# Altium schematic sheet Connectors.SchDoc
size A4
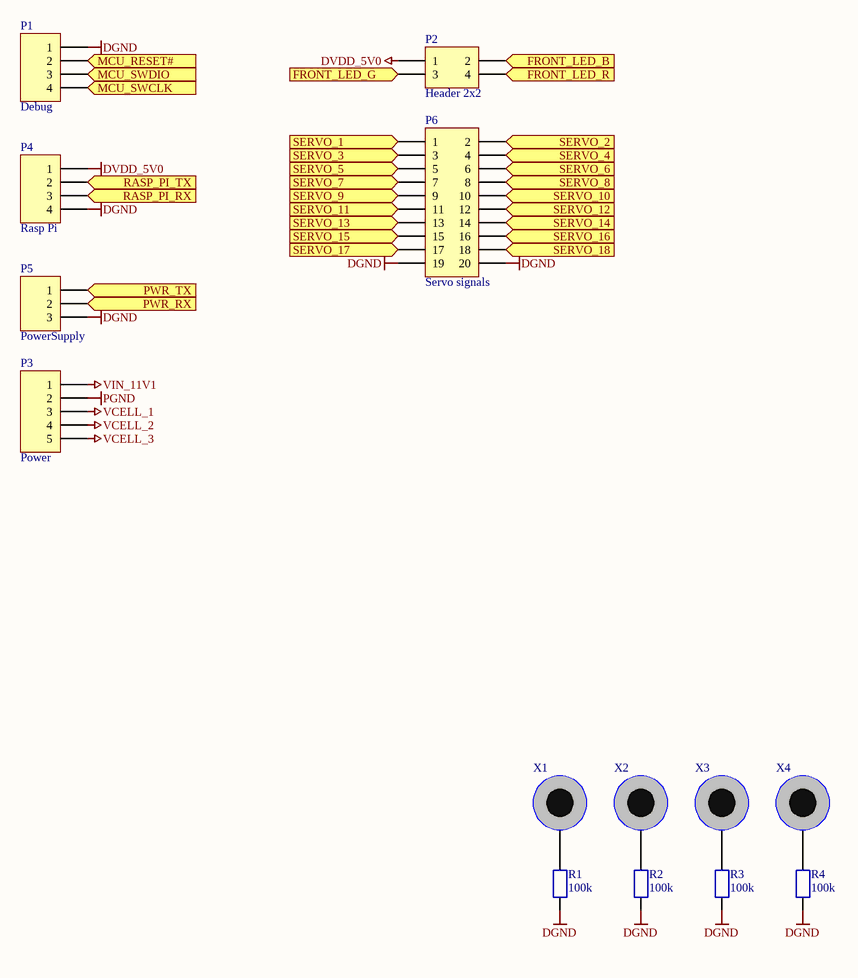
[diagram p0: Connectors.SchDoc]

## Parts
P1  Debug  [HDR_SMD_1X4_1.50]
P2  Header 2x2  [HDR_M_2X2_2.54]
P3  Power  [HDR_M_1X5_2.54_OUTLINE]
P4  Rasp Pi  [HDR_M_1X4_2.54]
P5  PowerSupply  [HDR_M_1X3_2.54]
P6  Servo signals  [HDR_M_2X10_2.54_OUTLINE]
R1  100k  [R_0603/1608]
R2  100k  [R_0603/1608]
R3  100k  [R_0603/1608]
R4  100k  [R_0603/1608]
X1  Mounting hole  [HOLE_M2_D4.0/2.5]  (value not drawn)  (no BOM)
X2  Mounting hole  [HOLE_M2_D4.0/2.5]  (value not drawn)  (no BOM)
X3  Mounting hole  [HOLE_M2_D4.0/2.5]  (value not drawn)  (no BOM)
X4  Mounting hole  [HOLE_M2_D4.0/2.5]  (value not drawn)  (no BOM)

## Ports
FRONT_LED_B, FRONT_LED_G, FRONT_LED_R, MCU_RESET#, MCU_SWCLK, MCU_SWDIO, PWR_RX, PWR_TX, RASP_PI_RX, RASP_PI_TX, SERVO_1, SERVO_2, SERVO_3, SERVO_4, SERVO_5, SERVO_6, SERVO_7, SERVO_8, SERVO_9, SERVO_10, SERVO_11, SERVO_12, SERVO_13, SERVO_14, SERVO_15, SERVO_16, SERVO_17, SERVO_18

## Nets
DGND: P1.1 P4.4 P5.3 P6.19 P6.20 R1.2 R2.2 R3.2 R4.2
DVDD_5V0: P2.1 P4.1
PGND: P3.2
VCELL_1: P3.3
VCELL_2: P3.4
VCELL_3: P3.5
VIN_11V1: P3.1
FRONT_LED_B: P2.2 ; port FRONT_LED_B
FRONT_LED_G: P2.3 ; port FRONT_LED_G
FRONT_LED_R: P2.4 ; port FRONT_LED_R
MCU_RESET#: P1.2 ; port MCU_RESET#
MCU_SWCLK: P1.4 ; port MCU_SWCLK
MCU_SWDIO: P1.3 ; port MCU_SWDIO
PWR_RX: P5.2 ; port PWR_RX
PWR_TX: P5.1 ; port PWR_TX
RASP_PI_RX: P4.3 ; port RASP_PI_RX
RASP_PI_TX: P4.2 ; port RASP_PI_TX
SERVO_1: P6.1 ; port SERVO_1
SERVO_2: P6.2 ; port SERVO_2
SERVO_3: P6.3 ; port SERVO_3
SERVO_4: P6.4 ; port SERVO_4
SERVO_5: P6.5 ; port SERVO_5
SERVO_6: P6.6 ; port SERVO_6
SERVO_7: P6.7 ; port SERVO_7
SERVO_8: P6.8 ; port SERVO_8
SERVO_9: P6.9 ; port SERVO_9
SERVO_10: P6.10 ; port SERVO_10
SERVO_11: P6.11 ; port SERVO_11
SERVO_12: P6.12 ; port SERVO_12
SERVO_13: P6.13 ; port SERVO_13
SERVO_14: P6.14 ; port SERVO_14
SERVO_15: P6.15 ; port SERVO_15
SERVO_16: P6.16 ; port SERVO_16
SERVO_17: P6.17 ; port SERVO_17
SERVO_18: P6.18 ; port SERVO_18
NetR1_1: R1.1 X1.1
NetR2_1: R2.1 X2.1
NetR3_1: R3.1 X3.1
NetR4_1: R4.1 X4.1

## Notes on the sheet
- Project:
- Title:
- HW Rev:
- Author:
- Date:
- Sheet
- of

## Library data of the parts
P1 P4 = Header 4: Header, 4-Pin; LatestRevisionDate: 17-Jul-2002; LatestRevisionNote: Re-released for DXP Platform.; Publisher: Altium Limited
P2 = Header 2x2: Header, 2-Pin; LatestRevisionDate: 17-Jul-2002; LatestRevisionNote: Re-released for DXP Platform.; Publisher: Altium Limited
P3 = Header 5: Header, 5-Pin; LatestRevisionDate: 17-Jul-2002; LatestRevisionNote: Re-released for DXP Platform.; Publisher: Altium Limited
P5 = Header 3: Header, 3-Pin; LatestRevisionDate: 17-Jul-2002; LatestRevisionNote: Re-released for DXP Platform.; Publisher: Altium Limited
P6 = Header 2x10: Header, 20-Pin; LatestRevisionDate: 17-Jul-2002; LatestRevisionNote: Re-released for DXP Platform.; Publisher: Altium Limited
R1-R4 = Resistor
X1-X4 = Mounting hole: Hole for screw M3, outline D6